# Altium schematic sheet Side PCB.SchDoc
size A4
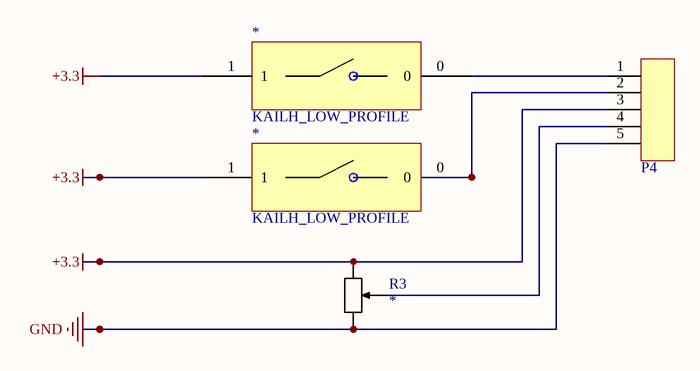
[diagram p0: Side PCB.SchDoc]

## Parts
(Parts that share a designator on the sheet are numbered #1, #2 ... from top to bottom, then left to right.)
*#1  KAILH_LOW_PROFILE  [KAILH_LOW_PROFILE]
*#2  KAILH_LOW_PROFILE  [KAILH_LOW_PROFILE]
P4  JST_SE_5PIN  [JST_SE_5PIN]  (value not drawn)
R3  R_POTMETER  (value not drawn)

## Nets
+3.3: *#1.1 *#2.1 P4.3 R3.1
GND: P4.5 R3.2
Net*#1_0: *#1.0 P4.1
Net*#2_0: *#2.0 P4.2

Not connected (* = marked no-connect by the designer): P4 4

## Library data of the parts
P4 = JST_SE_5PIN: Supplier 1: *; Supplier Part Number 1: *
R3 = R_POTMETER: Supplier 1: *; Supplier Part Number 1: *; Value: *